# Altium project hamamatsu_S13361-3050AE-08_adapter.PrjPcb
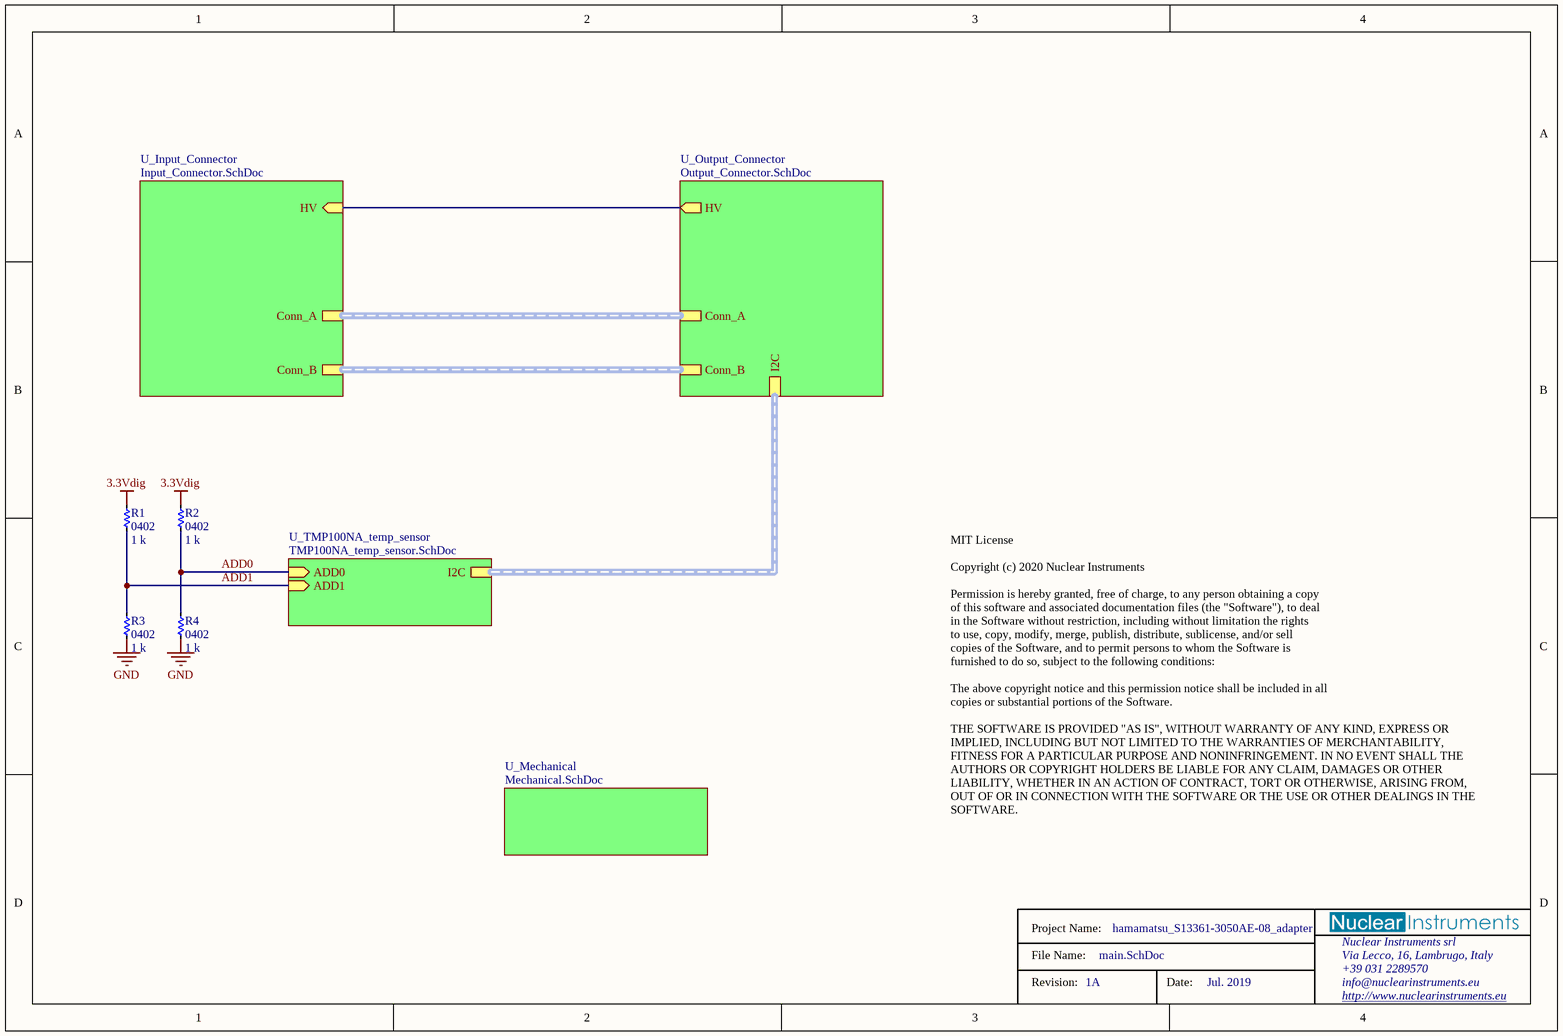
[diagram p0: main.SchDoc]
Data_Revisione: Jul. 2019; Nome_Progetto: hamamatsu_S13361-3050AE-08_adapter; Numero_Revisione: 1A; SARA_PCB_Number: 01840002987; SARA_Project_Number: 99990000399
5 sheets, 36 parts. Net scope: hierarchical (ports join the sheet entries above them; power ports are global).
Board file: hamamatsu_S13361-3050AE-08_adapter.PcbDoc
Sheets:
  main.SchDoc
    U_Mechanical = Mechanical.SchDoc
    U_TMP100NA_temp_sensor = TMP100NA_temp_sensor.SchDoc
    U_Output_Connector = Output_Connector.SchDoc
    U_Input_Connector = Input_Connector.SchDoc

## Sheet main.SchDoc
size A4; Organization: Altium Limited; Address1: L3, 12a Rodborough Rd; Address2: Frenchs Forest; Address3: NSW; Address4: Australia 2086

### Parts
R1  0402  value 1 k  [RESSMD0402]
R2  0402  value 1 k  [RESSMD0402]
R3  0402  value 1 k  [RESSMD0402]
R4  0402  value 1 k  [RESSMD0402]

### Sub-sheets
U_Input_Connector = Input_Connector.SchDoc: Conn_B (harness 32sig_B), Conn_A (harness 32sig_A), HV (in)
U_Mechanical = Mechanical.SchDoc: no entries
U_Output_Connector = Output_Connector.SchDoc: Conn_B (harness 32sig_B), Conn_A (harness 32sig_A), I2C (harness I2C), HV (out)
U_TMP100NA_temp_sensor = TMP100NA_temp_sensor.SchDoc: ADD0 (in), ADD1 (in), I2C (harness I2C)

### Nets
3.3Vdig: R1.1 R2.1
GND: R3.2 R4.2
ADD0: R2.2 R4.1 ; sheet U_TMP100NA_temp_sensor/ADD0
ADD1: R1.2 R3.1 ; sheet U_TMP100NA_temp_sensor/ADD1
HV: sheet U_Output_Connector/HV, sheet U_Input_Connector/HV

### Buses and harness runs
harness sheet U_Input_Connector/Conn_A = sheet U_Output_Connector/Conn_A
harness sheet U_Input_Connector/Conn_B = sheet U_Output_Connector/Conn_B
harness sheet U_Output_Connector/I2C = sheet U_TMP100NA_temp_sensor/I2C

### Notes on the sheet
- MIT License
  Copyright (c) 2020 Nuclear Instruments
  Permission is hereby granted, free of charge, to any person obtaining a copy
  of this software and associated documentation files (the "Software"), to deal
  in the Software without restriction, including without limitation the rights
  to use, copy, modify, merge, publish, distribute, sublicense, and/or sell
  copies of the Software, and to permit persons to whom the Software is
  furnished to do so, subject to the following conditions:
  The above copyright notice and this permission notice shall be included in all
  copies or substantial portions of the Software.
  THE SOFTWARE IS PROVIDED "AS IS", WITHOUT WARRANTY OF ANY KIND, EXPRESS OR
  IMPLIED, INCLUDING BUT NOT LIMITED TO THE WARRANTIES OF MERCHANTABILITY,
  FITNESS FOR A PARTICULAR PURPOSE AND NONINFRINGEMENT. IN NO EVENT SHALL THE
  AUTHORS OR COPYRIGHT HOLDERS BE LIABLE FOR ANY CLAIM, DAMAGES OR OTHER
  LIABILITY, WHETHER IN AN ACTION OF CONTRACT, TORT OR OTHERWISE, ARISING FROM,
  OUT OF OR IN CONNECTION WITH THE SOFTWARE OR THE USE OR OTHER DEALINGS IN THE
  SOFTWARE.
- Project Name:
- Revision:
- File Name:
- Date:
- Nuclear Instruments srl
- Via Lecco, 16, Lambrugo, Italy
- +39 031 2289570
- info@nuclearinstruments.eu
- http://www.nuclearinstruments.eu

### Library data of the parts
R1-R4 = RES0402-1k

## Sheet Mechanical.SchDoc
size A4; Organization: Altium Limited; Address1: L3, 12a Rodborough Rd; Address2: Frenchs Forest; Address3: NSW; Address4: Australia 2086
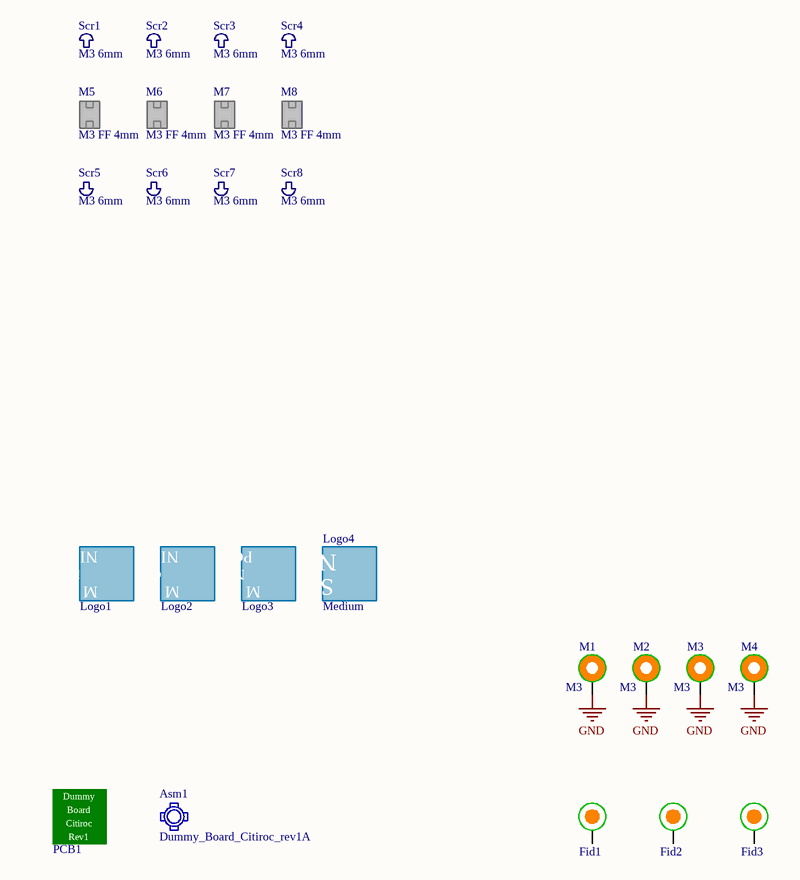
[diagram p1: Mechanical.SchDoc]

### Parts
Asm1  Dummy_Board_Citiroc_rev1A  (mechanical)
Fid1  PCB_Fiducial_Round_1mm  [PCB_Fiducial_Round_1mm]  (value not drawn)
Fid2  PCB_Fiducial_Round_1mm  [PCB_Fiducial_Round_1mm]  (value not drawn)
Fid3  PCB_Fiducial_Round_1mm  [PCB_Fiducial_Round_1mm]  (value not drawn)
Logo1  hamamatsu_S13361-3050AE-08_adapter  [NI_ProjectName_M_Serigraphy]  (value not drawn)
Logo2  NI_COMPLETE_M_LOGO  [NI_COMPLETE_M_LOGO]  (value not drawn)
Logo3  PCB_Number_M  [NI_PCB_Number_M_Serigraphy]  (value not drawn)
Logo4  Medium  [NI_SN_MEDIUM]
M1  M3  [PCBPad_M3_Head6mm]
M2  M3  [PCBPad_M3_Head6mm]
M3  M3  [PCBPad_M3_Head6mm]
M4  M3  [PCBPad_M3_Head6mm]
M5  M3 FF 4mm  (mechanical)
M6  M3 FF 4mm  (mechanical)
M7  M3 FF 4mm  (mechanical)
M8  M3 FF 4mm  (mechanical)
PCB1  PCB_Dummy_Board_Citiroc_rev1  (value not drawn)  (mechanical)
Scr1  M3 6mm  (mechanical)
Scr2  M3 6mm  (mechanical)
Scr3  M3 6mm  (mechanical)
Scr4  M3 6mm  (mechanical)
Scr5  M3 6mm  (mechanical)
Scr6  M3 6mm  (mechanical)
Scr7  M3 6mm  (mechanical)
Scr8  M3 6mm  (mechanical)

### Nets
GND: M1.1 M2.1 M3.1 M4.1

Not connected (* = marked no-connect by the designer): Fid1 1; Fid2 1; Fid3 1

### Notes on the sheet
- Project Name:
- Revision:
- File Name:
- Date:
- Nuclear Instruments srl
- Via Lecco, 16, Lambrugo, Italy
- +39 031 2289570
- info@nuclearinstruments.eu
- http://www.nuclearinstruments.eu
- (in symbol NI_COMPLETE_M_LOGO) NI; Complete; M
- (in symbol NI_PCB_Number_M_Serigraphy) PCB; Number; M
- (in symbol NI_ProjectName_M_Serigraphy) NI; Proj Name; M
- (in symbol NI_SN_MEDIUM) NI; SN
- (in symbol PCB_Dummy_Board_Citiroc_rev1) Dummy; Board; Citiroc; Rev1

### Library data of the parts
Asm1 = Assembly_Dummy_Board_Citiroc_rev1A
Logo1 = NI_ProjectName_M_Serigraphy
Logo3 = NI_PCB_Number_M_Serigraphy
Logo4 = NI_SN_MEDIUM
M1-M4 = PCBPad_M3_Head6mm
M5-M8 = Hex_Spacer_R30_M3_FF_4mm
Scr1-Scr8 = Screw_M3_6mm_Pozi_Duratool

## Sheet TMP100NA_temp_sensor.SchDoc
size A4; Organization: Altium Limited; Address1: L3, 12a Rodborough Rd; Address2: Frenchs Forest; Address3: NSW; Address4: Australia 2086
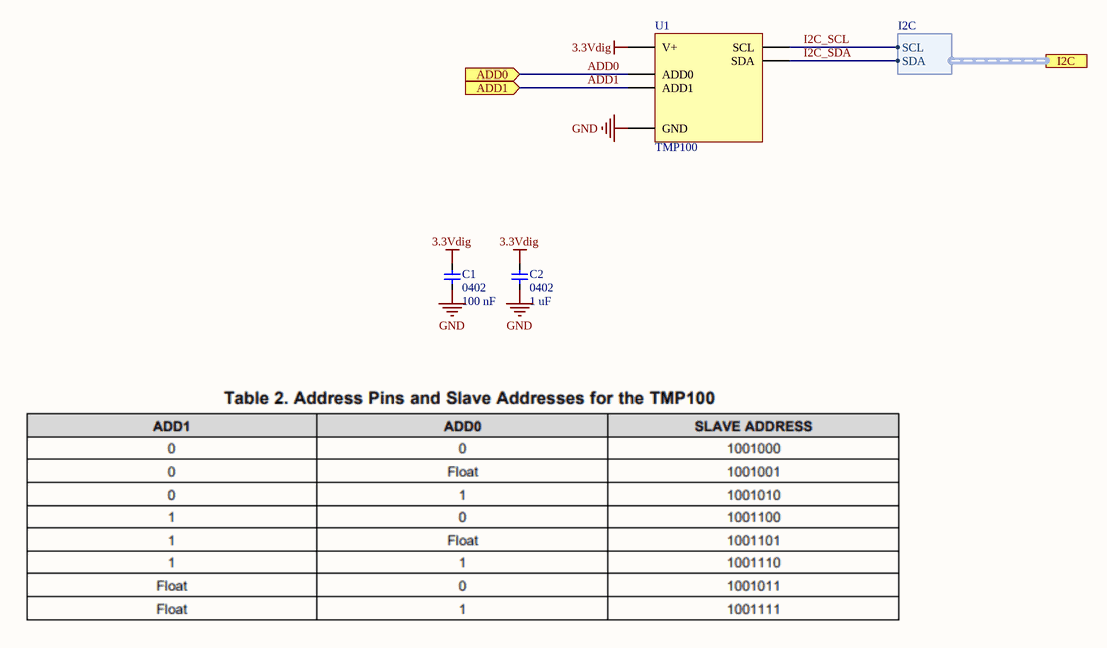
[diagram p2: TMP100NA_temp_sensor.SchDoc]

### Parts
C1  0402  value 100 nF  [CAPCERSMD0402]
C2  0402  value 1 uF  [CAPCERSMD0402]
U1  TMP100  [SOT6_P95W280L290H145]

### Ports
ADD0 (in), ADD1 (in), I2C (harness I2C)

### Harnesses
I2C: SCL, SDA

### Nets
3.3Vdig: C1.2 C2.2 U1.4(V+)
GND: C1.1 C2.1 U1.2(GND)
ADD0: U1.5(ADD0) ; port ADD0
ADD1: U1.3(ADD1) ; port ADD1
I2C_SCL: U1.1(SCL) ; port I2C.SCL
I2C_SDA: U1.6(SDA) ; port I2C.SDA

### Notes on the sheet
- Project Name:
- Revision:
- File Name:
- Date:
- Nuclear Instruments srl
- Via Lecco, 16, Lambrugo, Italy
- +39 031 2289570
- info@nuclearinstruments.eu
- http://www.nuclearinstruments.eu

### Library data of the parts
C1 = CAPCER0402_X7R_50V_100n
C2 = CAPCER0402_X5R_10V_1u
U1 = TMP100NA/250

## Sheet Output_Connector.SchDoc
size A4; Organization: Altium Limited; Address1: L3, 12a Rodborough Rd; Address2: Frenchs Forest; Address3: NSW; Address4: Australia 2086
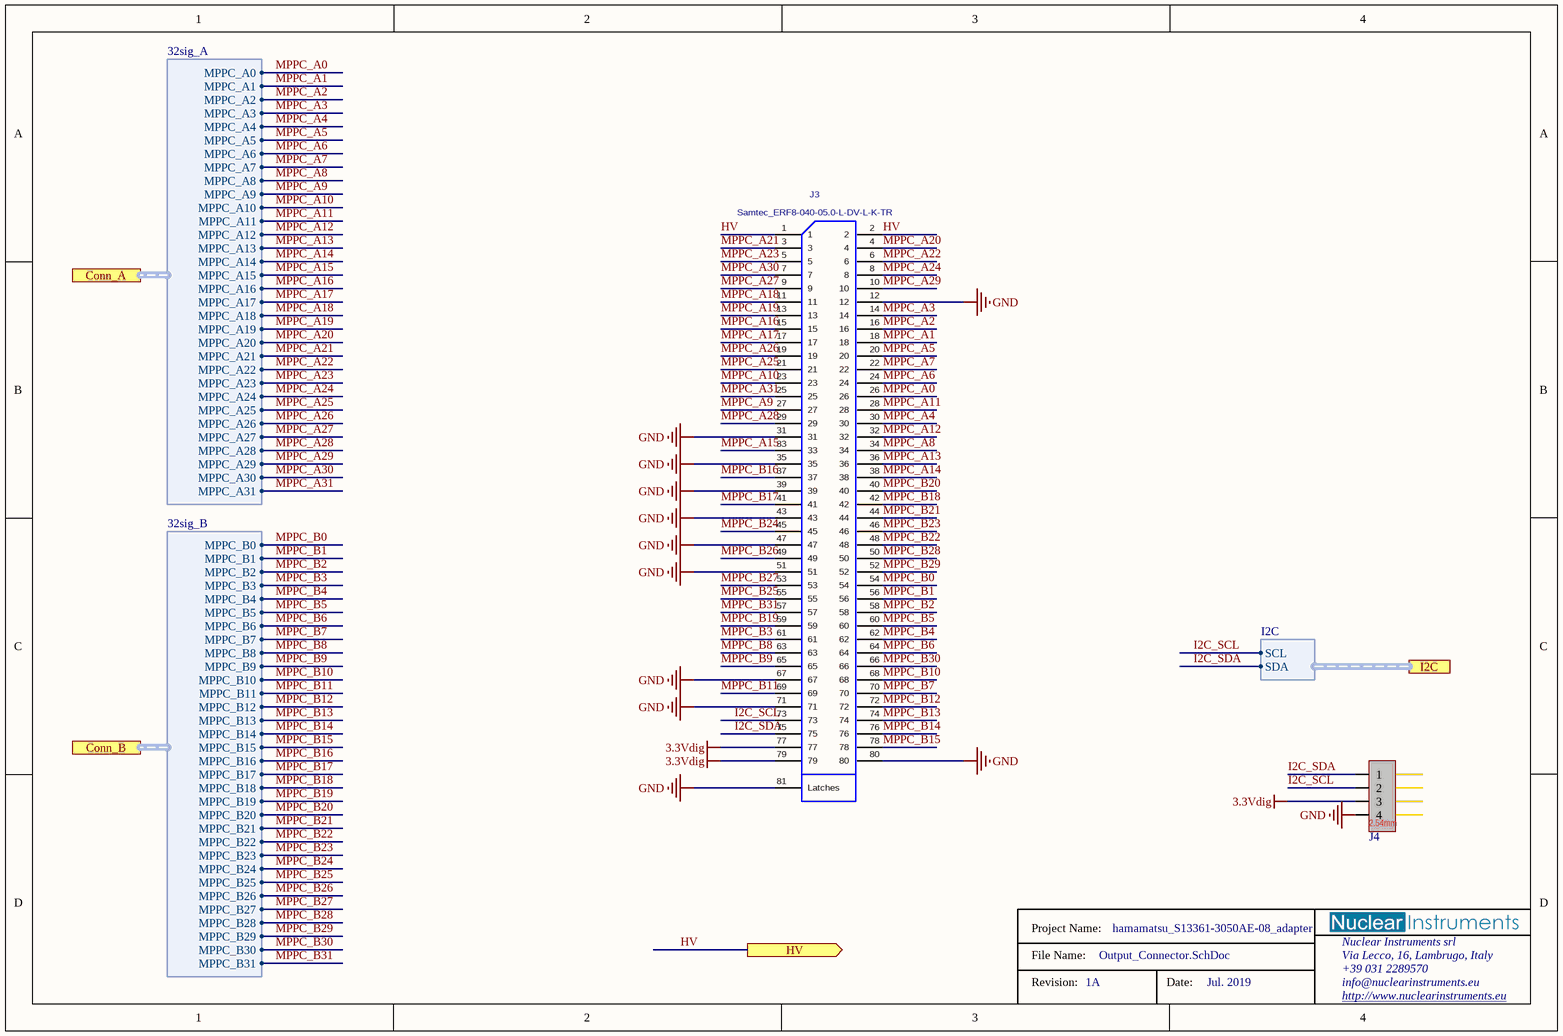
[diagram p3: Output_Connector.SchDoc]

### Parts
J3  Samtec_ERF8-040-05.0-L-DV-L-K-TR  [Samtec_ERF8-040-05.0-L-DV-L-K-TR]
J4  4 way, 2.54mm pitch  [Wurth_WR-PHD_4way_2.54mm_male]  (value not drawn)

### Ports
Conn_A (harness 32sig_A), Conn_B (harness 32sig_B), HV (out), I2C (harness I2C)

### Harnesses
32sig_B: MPPC_B0, MPPC_B1, MPPC_B2, MPPC_B3, MPPC_B4, MPPC_B5, MPPC_B6, MPPC_B7, MPPC_B8, MPPC_B9, MPPC_B10, MPPC_B11, MPPC_B12, MPPC_B13, MPPC_B14, MPPC_B15, MPPC_B16, MPPC_B17, MPPC_B18, MPPC_B19, MPPC_B20, MPPC_B21, MPPC_B22, MPPC_B23, MPPC_B24, MPPC_B25, MPPC_B26, MPPC_B27, MPPC_B28, MPPC_B29, MPPC_B30, MPPC_B31
32sig_A: MPPC_A0, MPPC_A1, MPPC_A2, MPPC_A3, MPPC_A4, MPPC_A5, MPPC_A6, MPPC_A7, MPPC_A8, MPPC_A9, MPPC_A10, MPPC_A11, MPPC_A12, MPPC_A13, MPPC_A14, MPPC_A15, MPPC_A16, MPPC_A17, MPPC_A18, MPPC_A19, MPPC_A20, MPPC_A21, MPPC_A22, MPPC_A23, MPPC_A24, MPPC_A25, MPPC_A26, MPPC_A27, MPPC_A28, MPPC_A29, MPPC_A30, MPPC_A31
I2C: SCL, SDA

### Nets
3.3Vdig: J3.77 J3.79 J4.3
GND: J3.12 J3.31 J3.35 J3.39 J3.43 J3.47 J3.51 J3.67 J3.71 J3.80 J3.81(Latches) J4.4
HV: J3.1 J3.2 ; port HV
I2C_SCL: J3.73 J4.2 ; port I2C.SCL
I2C_SDA: J3.75 J4.1 ; port I2C.SDA
MPPC_A0: J3.26 ; port Conn_A.MPPC_A0
MPPC_A1: J3.18 ; port Conn_A.MPPC_A1
MPPC_A2: J3.16 ; port Conn_A.MPPC_A2
MPPC_A3: J3.14 ; port Conn_A.MPPC_A3
MPPC_A4: J3.30 ; port Conn_A.MPPC_A4
MPPC_A5: J3.20 ; port Conn_A.MPPC_A5
MPPC_A6: J3.24 ; port Conn_A.MPPC_A6
MPPC_A7: J3.22 ; port Conn_A.MPPC_A7
MPPC_A8: J3.34 ; port Conn_A.MPPC_A8
MPPC_A9: J3.27 ; port Conn_A.MPPC_A9
MPPC_A10: J3.23 ; port Conn_A.MPPC_A10
MPPC_A11: J3.28 ; port Conn_A.MPPC_A11
MPPC_A12: J3.32 ; port Conn_A.MPPC_A12
MPPC_A13: J3.36 ; port Conn_A.MPPC_A13
MPPC_A14: J3.38 ; port Conn_A.MPPC_A14
MPPC_A15: J3.33 ; port Conn_A.MPPC_A15
MPPC_A16: J3.15 ; port Conn_A.MPPC_A16
MPPC_A17: J3.17 ; port Conn_A.MPPC_A17
MPPC_A18: J3.11 ; port Conn_A.MPPC_A18
MPPC_A19: J3.13 ; port Conn_A.MPPC_A19
MPPC_A20: J3.4 ; port Conn_A.MPPC_A20
MPPC_A21: J3.3 ; port Conn_A.MPPC_A21
MPPC_A22: J3.6 ; port Conn_A.MPPC_A22
MPPC_A23: J3.5 ; port Conn_A.MPPC_A23
MPPC_A24: J3.8 ; port Conn_A.MPPC_A24
MPPC_A25: J3.21 ; port Conn_A.MPPC_A25
MPPC_A26: J3.19 ; port Conn_A.MPPC_A26
MPPC_A27: J3.9 ; port Conn_A.MPPC_A27
MPPC_A28: J3.29 ; port Conn_A.MPPC_A28
MPPC_A29: J3.10 ; port Conn_A.MPPC_A29
MPPC_A30: J3.7 ; port Conn_A.MPPC_A30
MPPC_A31: J3.25 ; port Conn_A.MPPC_A31
MPPC_B0: J3.54 ; port Conn_B.MPPC_B0
MPPC_B1: J3.56 ; port Conn_B.MPPC_B1
MPPC_B2: J3.58 ; port Conn_B.MPPC_B2
MPPC_B3: J3.61 ; port Conn_B.MPPC_B3
MPPC_B4: J3.62 ; port Conn_B.MPPC_B4
MPPC_B5: J3.60 ; port Conn_B.MPPC_B5
MPPC_B6: J3.64 ; port Conn_B.MPPC_B6
MPPC_B7: J3.70 ; port Conn_B.MPPC_B7
MPPC_B8: J3.63 ; port Conn_B.MPPC_B8
MPPC_B9: J3.65 ; port Conn_B.MPPC_B9
MPPC_B10: J3.68 ; port Conn_B.MPPC_B10
MPPC_B11: J3.69 ; port Conn_B.MPPC_B11
MPPC_B12: J3.72 ; port Conn_B.MPPC_B12
MPPC_B13: J3.74 ; port Conn_B.MPPC_B13
MPPC_B14: J3.76 ; port Conn_B.MPPC_B14
MPPC_B15: J3.78 ; port Conn_B.MPPC_B15
MPPC_B16: J3.37 ; port Conn_B.MPPC_B16
MPPC_B17: J3.41 ; port Conn_B.MPPC_B17
MPPC_B18: J3.42 ; port Conn_B.MPPC_B18
MPPC_B19: J3.59 ; port Conn_B.MPPC_B19
MPPC_B20: J3.40 ; port Conn_B.MPPC_B20
MPPC_B21: J3.44 ; port Conn_B.MPPC_B21
MPPC_B22: J3.48 ; port Conn_B.MPPC_B22
MPPC_B23: J3.46 ; port Conn_B.MPPC_B23
MPPC_B24: J3.45 ; port Conn_B.MPPC_B24
MPPC_B25: J3.55 ; port Conn_B.MPPC_B25
MPPC_B26: J3.49 ; port Conn_B.MPPC_B26
MPPC_B27: J3.53 ; port Conn_B.MPPC_B27
MPPC_B28: J3.50 ; port Conn_B.MPPC_B28
MPPC_B29: J3.52 ; port Conn_B.MPPC_B29
MPPC_B30: J3.66 ; port Conn_B.MPPC_B30
MPPC_B31: J3.57 ; port Conn_B.MPPC_B31

### Notes on the sheet
- Project Name:
- Revision:
- File Name:
- Date:
- Nuclear Instruments srl
- Via Lecco, 16, Lambrugo, Italy
- +39 031 2289570
- info@nuclearinstruments.eu
- http://www.nuclearinstruments.eu
- (in symbol Wurth_WR-PHD_4way_2.54mm_male) 2.54mm

### Library data of the parts
J3 = Samtec_ERF8-040-05.0-L-DV-L-K-TR: 0.8mm Edge Rate Socket Assembly, Double Vertical Row, 40 Pins.
J4 = Wurth_WR-PHD_4way_2.54mm_male: Male 4 way 2.54 mm

## Sheet Input_Connector.SchDoc
size A4
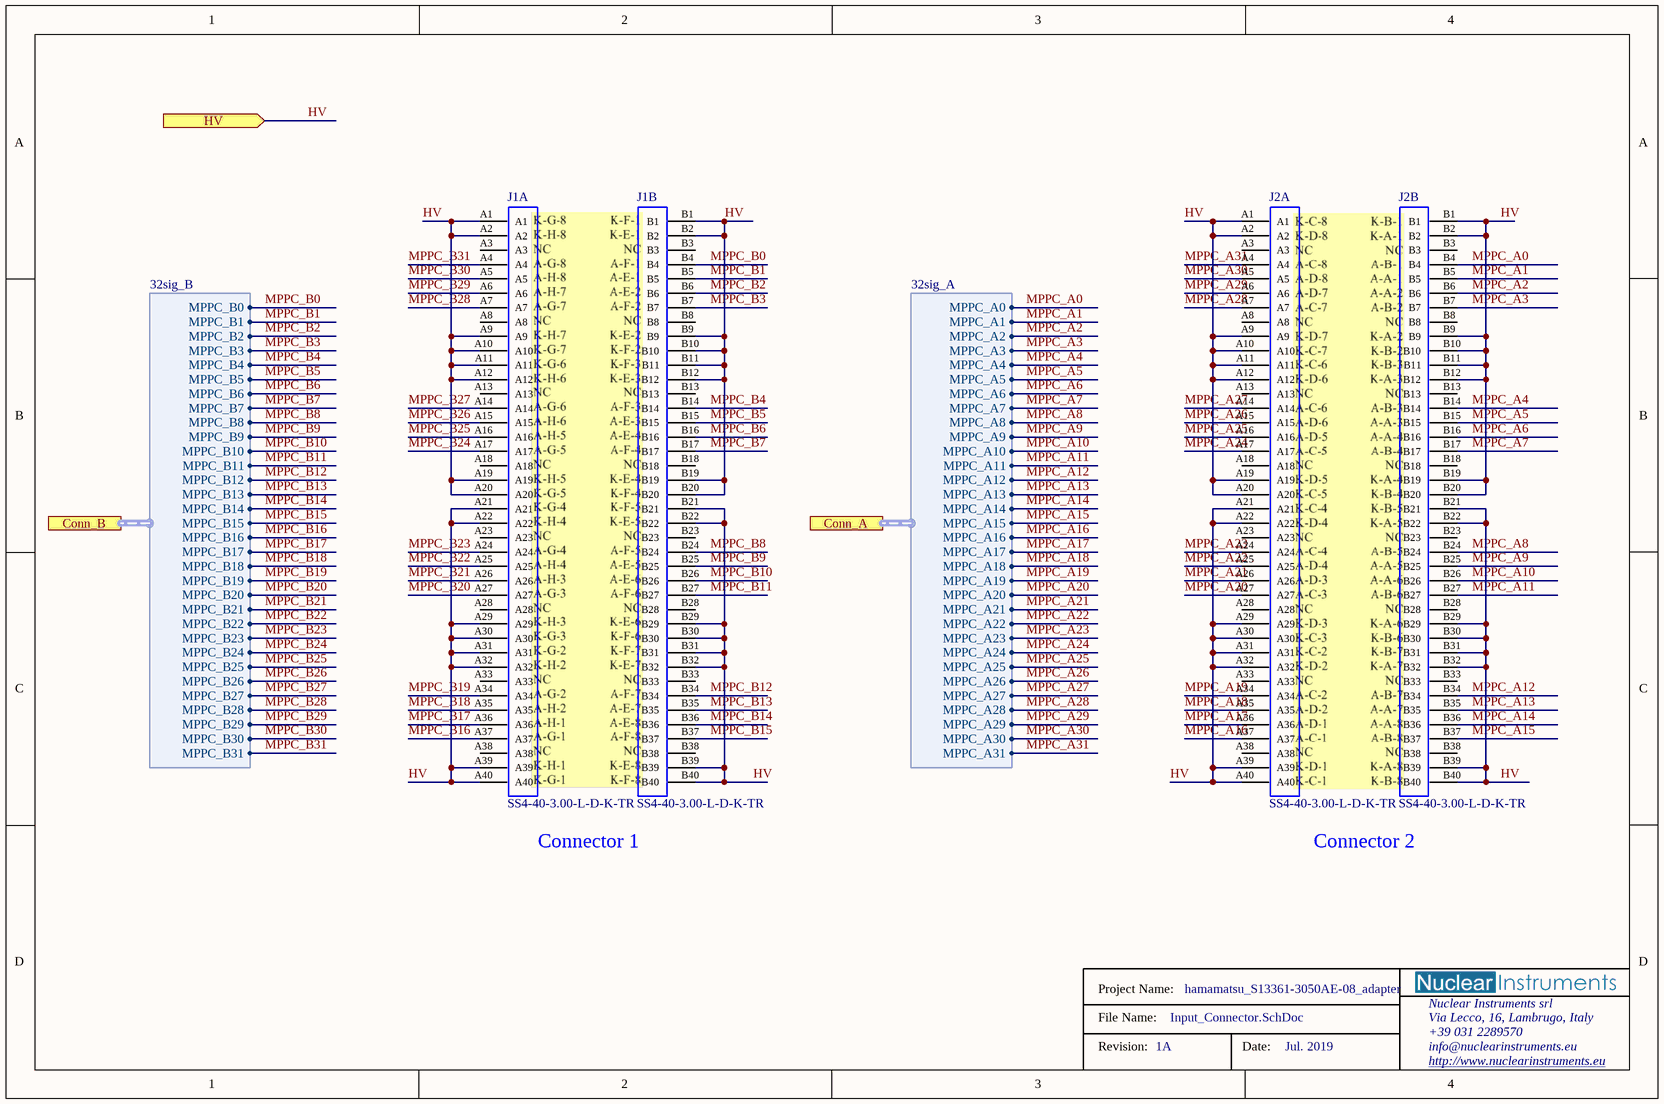
[diagram p4: Input_Connector.SchDoc]

### Parts
J1  SS4-40-3.00-L-D-K-TR  [Samtec_SS4-40-3.00-L-D-K-TR]  (parts A,B of 2)
J2  SS4-40-3.00-L-D-K-TR  [Samtec_SS4-40-3.00-L-D-K-TR]  (parts A,B of 2)

### Ports
Conn_A (harness 32sig_A), Conn_B (harness 32sig_B), HV (in)

### Harnesses
32sig_B: MPPC_B0, MPPC_B1, MPPC_B2, MPPC_B3, MPPC_B4, MPPC_B5, MPPC_B6, MPPC_B7, MPPC_B8, MPPC_B9, MPPC_B10, MPPC_B11, MPPC_B12, MPPC_B13, MPPC_B14, MPPC_B15, MPPC_B16, MPPC_B17, MPPC_B18, MPPC_B19, MPPC_B20, MPPC_B21, MPPC_B22, MPPC_B23, MPPC_B24, MPPC_B25, MPPC_B26, MPPC_B27, MPPC_B28, MPPC_B29, MPPC_B30, MPPC_B31
32sig_A: MPPC_A0, MPPC_A1, MPPC_A2, MPPC_A3, MPPC_A4, MPPC_A5, MPPC_A6, MPPC_A7, MPPC_A8, MPPC_A9, MPPC_A10, MPPC_A11, MPPC_A12, MPPC_A13, MPPC_A14, MPPC_A15, MPPC_A16, MPPC_A17, MPPC_A18, MPPC_A19, MPPC_A20, MPPC_A21, MPPC_A22, MPPC_A23, MPPC_A24, MPPC_A25, MPPC_A26, MPPC_A27, MPPC_A28, MPPC_A29, MPPC_A30, MPPC_A31

### Nets
HV: J1.A1 J1.A2 J1.A9 J1.A10 J1.A11 J1.A12 J1.A19 J1.A20 J1.A21 J1.A22 J1.A29 J1.A30 J1.A31 J1.A32 J1.A39 J1.A40 J1.B1 J1.B2 J1.B9 J1.B10 J1.B11 J1.B12 J1.B19 J1.B20 J1.B21 J1.B22 J1.B29 J1.B30 J1.B31 J1.B32 J1.B39 J1.B40 J2.A1 J2.A2 J2.A9 J2.A10 J2.A11 J2.A12 J2.A19 J2.A20 J2.A21 J2.A22 J2.A29 J2.A30 J2.A31 J2.A32 J2.A39 J2.A40 J2.B1 J2.B2 J2.B9 J2.B10 J2.B11 J2.B12 J2.B19 J2.B20 J2.B21 J2.B22 J2.B29 J2.B30 J2.B31 J2.B32 J2.B39 J2.B40 ; port HV
MPPC_A0: J2.B4 ; port Conn_A.MPPC_A0
MPPC_A1: J2.B5 ; port Conn_A.MPPC_A1
MPPC_A2: J2.B6 ; port Conn_A.MPPC_A2
MPPC_A3: J2.B7 ; port Conn_A.MPPC_A3
MPPC_A4: J2.B14 ; port Conn_A.MPPC_A4
MPPC_A5: J2.B15 ; port Conn_A.MPPC_A5
MPPC_A6: J2.B16 ; port Conn_A.MPPC_A6
MPPC_A7: J2.B17 ; port Conn_A.MPPC_A7
MPPC_A8: J2.B24 ; port Conn_A.MPPC_A8
MPPC_A9: J2.B25 ; port Conn_A.MPPC_A9
MPPC_A10: J2.B26 ; port Conn_A.MPPC_A10
MPPC_A11: J2.B27 ; port Conn_A.MPPC_A11
MPPC_A12: J2.B34 ; port Conn_A.MPPC_A12
MPPC_A13: J2.B35 ; port Conn_A.MPPC_A13
MPPC_A14: J2.B36 ; port Conn_A.MPPC_A14
MPPC_A15: J2.B37 ; port Conn_A.MPPC_A15
MPPC_A16: J2.A37 ; port Conn_A.MPPC_A16
MPPC_A17: J2.A36 ; port Conn_A.MPPC_A17
MPPC_A18: J2.A35 ; port Conn_A.MPPC_A18
MPPC_A19: J2.A34 ; port Conn_A.MPPC_A19
MPPC_A20: J2.A27 ; port Conn_A.MPPC_A20
MPPC_A21: J2.A26 ; port Conn_A.MPPC_A21
MPPC_A22: J2.A25 ; port Conn_A.MPPC_A22
MPPC_A23: J2.A24 ; port Conn_A.MPPC_A23
MPPC_A24: J2.A17 ; port Conn_A.MPPC_A24
MPPC_A25: J2.A16 ; port Conn_A.MPPC_A25
MPPC_A26: J2.A15 ; port Conn_A.MPPC_A26
MPPC_A27: J2.A14 ; port Conn_A.MPPC_A27
MPPC_A28: J2.A7 ; port Conn_A.MPPC_A28
MPPC_A29: J2.A6 ; port Conn_A.MPPC_A29
MPPC_A30: J2.A5 ; port Conn_A.MPPC_A30
MPPC_A31: J2.A4 ; port Conn_A.MPPC_A31
MPPC_B0: J1.B4 ; port Conn_B.MPPC_B0
MPPC_B1: J1.B5 ; port Conn_B.MPPC_B1
MPPC_B2: J1.B6 ; port Conn_B.MPPC_B2
MPPC_B3: J1.B7 ; port Conn_B.MPPC_B3
MPPC_B4: J1.B14 ; port Conn_B.MPPC_B4
MPPC_B5: J1.B15 ; port Conn_B.MPPC_B5
MPPC_B6: J1.B16 ; port Conn_B.MPPC_B6
MPPC_B7: J1.B17 ; port Conn_B.MPPC_B7
MPPC_B8: J1.B24 ; port Conn_B.MPPC_B8
MPPC_B9: J1.B25 ; port Conn_B.MPPC_B9
MPPC_B10: J1.B26 ; port Conn_B.MPPC_B10
MPPC_B11: J1.B27 ; port Conn_B.MPPC_B11
MPPC_B12: J1.B34 ; port Conn_B.MPPC_B12
MPPC_B13: J1.B35 ; port Conn_B.MPPC_B13
MPPC_B14: J1.B36 ; port Conn_B.MPPC_B14
MPPC_B15: J1.B37 ; port Conn_B.MPPC_B15
MPPC_B16: J1.A37 ; port Conn_B.MPPC_B16
MPPC_B17: J1.A36 ; port Conn_B.MPPC_B17
MPPC_B18: J1.A35 ; port Conn_B.MPPC_B18
MPPC_B19: J1.A34 ; port Conn_B.MPPC_B19
MPPC_B20: J1.A27 ; port Conn_B.MPPC_B20
MPPC_B21: J1.A26 ; port Conn_B.MPPC_B21
MPPC_B22: J1.A25 ; port Conn_B.MPPC_B22
MPPC_B23: J1.A24 ; port Conn_B.MPPC_B23
MPPC_B24: J1.A17 ; port Conn_B.MPPC_B24
MPPC_B25: J1.A16 ; port Conn_B.MPPC_B25
MPPC_B26: J1.A15 ; port Conn_B.MPPC_B26
MPPC_B27: J1.A14 ; port Conn_B.MPPC_B27
MPPC_B28: J1.A7 ; port Conn_B.MPPC_B28
MPPC_B29: J1.A6 ; port Conn_B.MPPC_B29
MPPC_B30: J1.A5 ; port Conn_B.MPPC_B30
MPPC_B31: J1.A4 ; port Conn_B.MPPC_B31

Not connected (* = marked no-connect by the designer): J1 A3 A8 A13 A18 A23 A28 A33 A38 B3 B8 B13 B18 B23 B28 B33 B38; J2 A3 A8 A13 A18 A23 A28 A33 A38 B3 B8 B13 B18 B23 B28 B33 B38

### Notes on the sheet
- (near J1) Connector 1
- (near J2) Connector 2
- Project Name:
- Revision:
- File Name:
- Date:
- Nuclear Instruments srl
- Via Lecco, 16, Lambrugo, Italy
- +39 031 2289570
- info@nuclearinstruments.eu
- http://www.nuclearinstruments.eu

### Library data of the parts
J1 J2 = Samtec_SS4-40-3.00-L-D-K-TR: ULTRA FINE PITCH SOCKET

## Nets that join several sheets
3.3Vdig: main (R1.1 R2.1), TMP100NA_temp_sensor (C1.2 C2.2 U1.4), Output_Connector (J3.77 J3.79 J4.3)
GND: main (R3.2 R4.2), Mechanical (M1.1 M2.1 M3.1 M4.1), TMP100NA_temp_sensor (C1.1 C2.1 U1.2), Output_Connector (12 pins)
ADD0: main (R2.2 R4.1), TMP100NA_temp_sensor (U1.5)
ADD1: main (R1.2 R3.1), TMP100NA_temp_sensor (U1.3)
HV: Output_Connector (J3.1 J3.2), Input_Connector (64 pins)
I2C_SCL: TMP100NA_temp_sensor (U1.1), Output_Connector (J3.73 J4.2)
I2C_SDA: TMP100NA_temp_sensor (U1.6), Output_Connector (J3.75 J4.1)
MPPC_A0: Output_Connector (J3.26), Input_Connector (J2.B4)
MPPC_A1: Output_Connector (J3.18), Input_Connector (J2.B5)
MPPC_A2: Output_Connector (J3.16), Input_Connector (J2.B6)
MPPC_A3: Output_Connector (J3.14), Input_Connector (J2.B7)
MPPC_A4: Output_Connector (J3.30), Input_Connector (J2.B14)
MPPC_A5: Output_Connector (J3.20), Input_Connector (J2.B15)
MPPC_A6: Output_Connector (J3.24), Input_Connector (J2.B16)
MPPC_A7: Output_Connector (J3.22), Input_Connector (J2.B17)
MPPC_A8: Output_Connector (J3.34), Input_Connector (J2.B24)
MPPC_A9: Output_Connector (J3.27), Input_Connector (J2.B25)
MPPC_A10: Output_Connector (J3.23), Input_Connector (J2.B26)
MPPC_A11: Output_Connector (J3.28), Input_Connector (J2.B27)
MPPC_A12: Output_Connector (J3.32), Input_Connector (J2.B34)
MPPC_A13: Output_Connector (J3.36), Input_Connector (J2.B35)
MPPC_A14: Output_Connector (J3.38), Input_Connector (J2.B36)
MPPC_A15: Output_Connector (J3.33), Input_Connector (J2.B37)
MPPC_A16: Output_Connector (J3.15), Input_Connector (J2.A37)
MPPC_A17: Output_Connector (J3.17), Input_Connector (J2.A36)
MPPC_A18: Output_Connector (J3.11), Input_Connector (J2.A35)
MPPC_A19: Output_Connector (J3.13), Input_Connector (J2.A34)
MPPC_A20: Output_Connector (J3.4), Input_Connector (J2.A27)
MPPC_A21: Output_Connector (J3.3), Input_Connector (J2.A26)
MPPC_A22: Output_Connector (J3.6), Input_Connector (J2.A25)
MPPC_A23: Output_Connector (J3.5), Input_Connector (J2.A24)
MPPC_A24: Output_Connector (J3.8), Input_Connector (J2.A17)
MPPC_A25: Output_Connector (J3.21), Input_Connector (J2.A16)
MPPC_A26: Output_Connector (J3.19), Input_Connector (J2.A15)
MPPC_A27: Output_Connector (J3.9), Input_Connector (J2.A14)
MPPC_A28: Output_Connector (J3.29), Input_Connector (J2.A7)
MPPC_A29: Output_Connector (J3.10), Input_Connector (J2.A6)
MPPC_A30: Output_Connector (J3.7), Input_Connector (J2.A5)
MPPC_A31: Output_Connector (J3.25), Input_Connector (J2.A4)
MPPC_B0: Output_Connector (J3.54), Input_Connector (J1.B4)
MPPC_B1: Output_Connector (J3.56), Input_Connector (J1.B5)
MPPC_B2: Output_Connector (J3.58), Input_Connector (J1.B6)
MPPC_B3: Output_Connector (J3.61), Input_Connector (J1.B7)
MPPC_B4: Output_Connector (J3.62), Input_Connector (J1.B14)
MPPC_B5: Output_Connector (J3.60), Input_Connector (J1.B15)
MPPC_B6: Output_Connector (J3.64), Input_Connector (J1.B16)
MPPC_B7: Output_Connector (J3.70), Input_Connector (J1.B17)
MPPC_B8: Output_Connector (J3.63), Input_Connector (J1.B24)
MPPC_B9: Output_Connector (J3.65), Input_Connector (J1.B25)
MPPC_B10: Output_Connector (J3.68), Input_Connector (J1.B26)
MPPC_B11: Output_Connector (J3.69), Input_Connector (J1.B27)
MPPC_B12: Output_Connector (J3.72), Input_Connector (J1.B34)
MPPC_B13: Output_Connector (J3.74), Input_Connector (J1.B35)
MPPC_B14: Output_Connector (J3.76), Input_Connector (J1.B36)
MPPC_B15: Output_Connector (J3.78), Input_Connector (J1.B37)
MPPC_B16: Output_Connector (J3.37), Input_Connector (J1.A37)
MPPC_B17: Output_Connector (J3.41), Input_Connector (J1.A36)
MPPC_B18: Output_Connector (J3.42), Input_Connector (J1.A35)
MPPC_B19: Output_Connector (J3.59), Input_Connector (J1.A34)
MPPC_B20: Output_Connector (J3.40), Input_Connector (J1.A27)
MPPC_B21: Output_Connector (J3.44), Input_Connector (J1.A26)
MPPC_B22: Output_Connector (J3.48), Input_Connector (J1.A25)
MPPC_B23: Output_Connector (J3.46), Input_Connector (J1.A24)
MPPC_B24: Output_Connector (J3.45), Input_Connector (J1.A17)
MPPC_B25: Output_Connector (J3.55), Input_Connector (J1.A16)
MPPC_B26: Output_Connector (J3.49), Input_Connector (J1.A15)
MPPC_B27: Output_Connector (J3.53), Input_Connector (J1.A14)
MPPC_B28: Output_Connector (J3.50), Input_Connector (J1.A7)
MPPC_B29: Output_Connector (J3.52), Input_Connector (J1.A6)
MPPC_B30: Output_Connector (J3.66), Input_Connector (J1.A5)
MPPC_B31: Output_Connector (J3.57), Input_Connector (J1.A4)